# Altium schematic sheet GPIO-SDIO.SchDoc: =ProjectTitle
size 297 x 209 mm; Address1: Address1; Address2: Address2; Address3: Address3; Address4: Address4; SheetNumber: 7; SheetTotal: 16; Scale: 1:1; DocumentType: Схема электрическая принципиальная
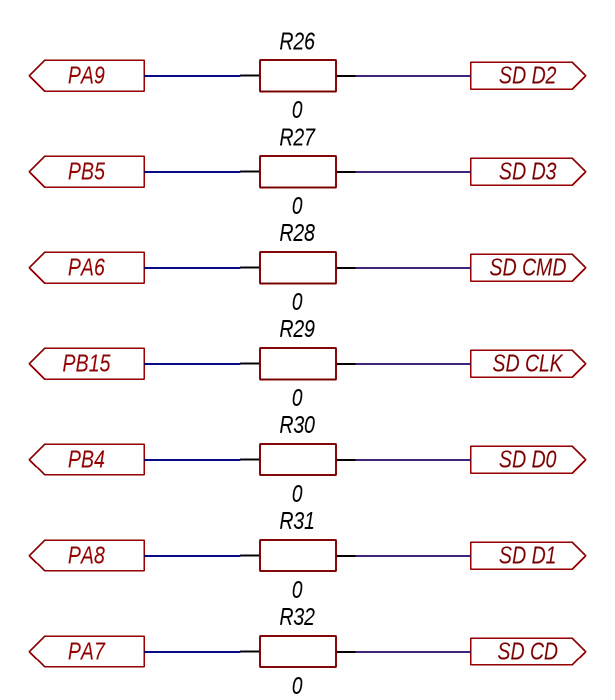
[diagram p0: GPIO-SDIO.SchDoc]

## Parts
R26  0  [CH0402R]
R27  0  [CH0402R]
R28  0  [CH0402R]
R29  0  [CH0402R]
R30  0  [CH0402R]
R31  0  [CH0402R]
R32  0  [CH0402R]

## Ports
PA6 (out), PA7 (out), PA8 (out), PA9 (out), PB4 (out), PB5 (out), PB15 (out), SD CD (out), SD CLK (out), SD CMD (out), SD D0 (out), SD D1 (out), SD D2 (out), SD D3 (out)

## Nets
PA6: R28.1 ; port PA6
PA7: R32.1 ; port PA7
PA8: R31.1 ; port PA8
PA9: R26.1 ; port PA9
PB4: R30.1 ; port PB4
PB5: R27.1 ; port PB5
PB15: R29.1 ; port PB15
SD CD: R32.2 ; port SD CD
SD CLK: R29.2 ; port SD CLK
SD CMD: R28.2 ; port SD CMD
SD D0: R30.2 ; port SD D0
SD D1: R31.2 ; port SD D1
SD D2: R26.2 ; port SD D2
SD D3: R27.2 ; port SD D3

## Notes on the sheet
- Изм.
- Лист
- № докум.
- Подп.
- Дата
- Копировал
- Формат А4

## Library data of the parts
R26-R32 = Resistor: Manufacturer: *; Model: *; HelpURL: *; ComponentKind: *; Value: 0